# EAGLE schematic Echo Chamber (EAGLE 6.6.0)

## Sheet 1 of 3: Power Filtering
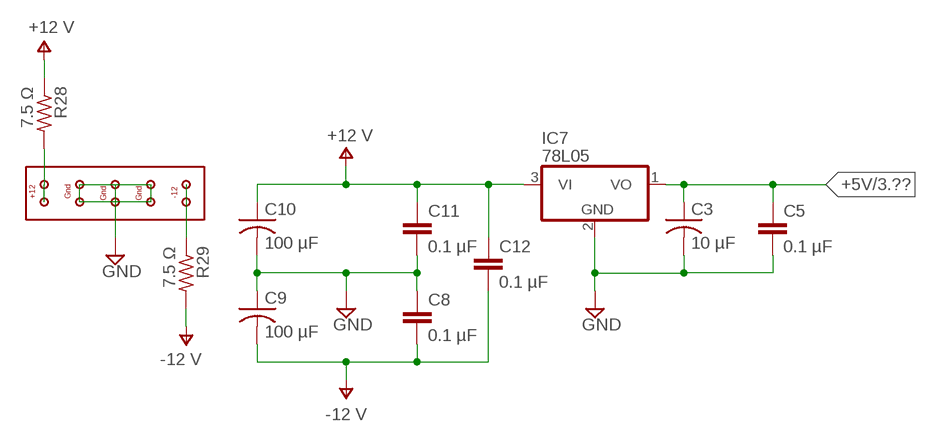
[diagram p0: schematic, sheet 1]

### Parts
C3  10 µF  C-US025-060X050  [C025-060X050]
C5  0.1 µF  C5/2.5  [C5B2.5]
C8  0.1 µF  C5/2.5  [C5B2.5]
C9  100 µF  C-US025-060X050  [C025-060X050]
C10  100 µF  C-US025-060X050  [C025-060X050]
C11  0.1 µF  C5/2.5  [C5B2.5]
C12  0.1 µF  C5/2.5  [C5B2.5]
IC7  78L05  78L05Z  [TO92]
R28  7.5 Ω  R-US_0204/7  [0204/7]
R29  7.5 Ω  R-US_0204/7  [0204/7]
U$2  EURORACK-POWER  [EURORACK-POWER]

### Nets
+5V: C3.1 C5.1 IC7.1(VO) ; also sheet 3
GND: C3.2 C5.2 C8.1 C9.1 C10.2 C11.2 IC7.2(GND) U$2.P$3 U$2.P$4 U$2.P$5 U$2.P$6 U$2.P$7 U$2.P$8 ; also sheet 2,3
N$20: R29.1 U$2.P$9 U$2.P$10
N$36: R28.2 U$2.P$1 U$2.P$2
V+: C10.1 C11.1 C12.1 IC7.3(VI) R28.1 ; supply symbol labelled +12 V
V-: C8.2 C9.2 C12.2 R29.2 ; supply symbol labelled -12 V ; also sheet 2

## Sheet 2 of 3: Audio In/Out
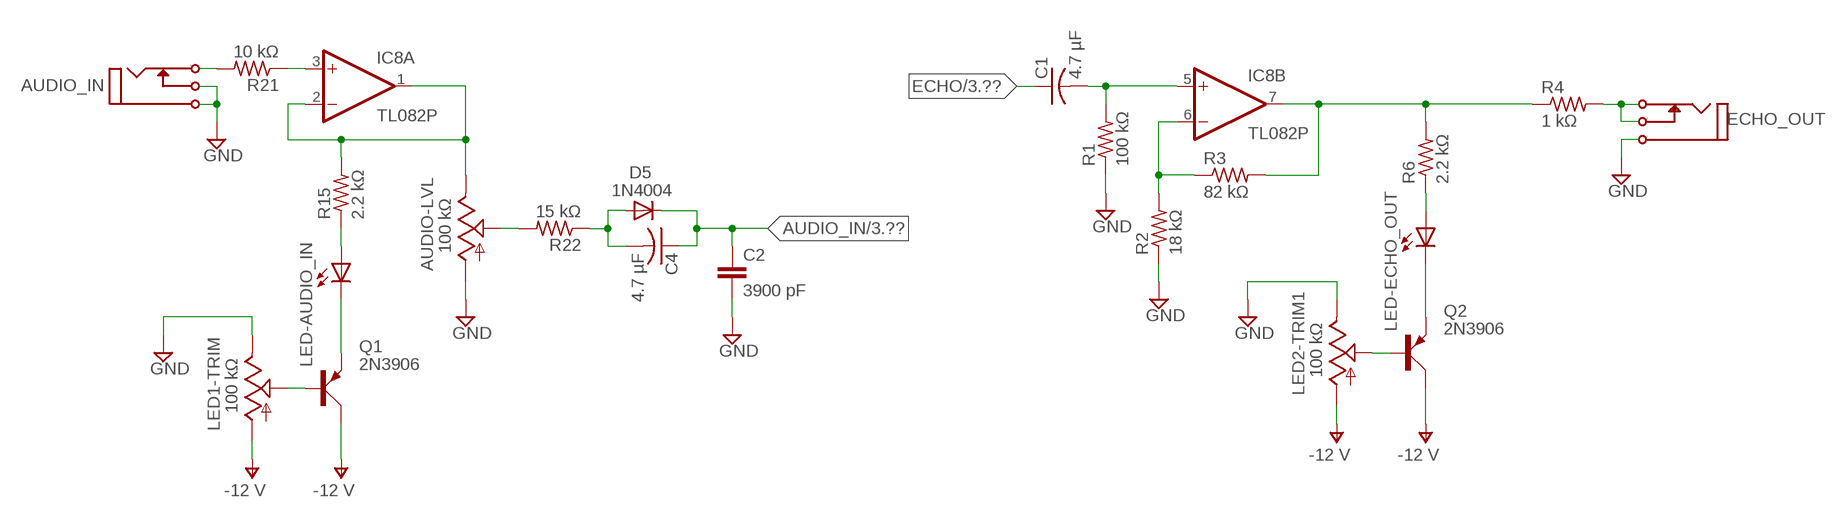
[diagram p1: schematic, sheet 2]

### Parts
AUDIO-LVL  100 kΩ  TRIM_US-B64Y  [B64Y]
AUDIO_IN  I/O  MONO_JACK  [MONO_JACK]
C1  4.7 µF  C-US025-060X050  [C025-060X050]
C2  3900 pF  C5/2.5  [C5B2.5]
C4  4.7 µF  C-US025-060X050  [C025-060X050]
D5  1N4004  [DO41-10]
ECHO_OUT  I/O  MONO_JACK  [MONO_JACK]
IC8  TL082P  [DIL08]
LED1-TRIM  100 kΩ  TRIM_US-B64Y  [B64Y]
LED2-TRIM1  100 kΩ  TRIM_US-B64Y  [B64Y]
LED-AUDIO_IN  LED3MM  [LED3MM]
LED-ECHO_OUT  LED3MM  [LED3MM]
Q1  2N3906  [TO92D]
Q2  2N3906  [TO92D]
R1  100 kΩ  R-US_0204/7  [0204/7]
R2  18 kΩ  R-US_0204/7  [0204/7]
R3  82 kΩ  R-US_0204/7  [0204/7]
R4  1 kΩ  R-US_0204/7  [0204/7]
R6  2.2 kΩ  R-US_0204/7  [0204/7]
R15  2.2 kΩ  R-US_0204/7  [0204/7]
R21  10 kΩ  R-US_0204/7  [0204/7]
R22  15 kΩ  R-US_0204/7  [0204/7]

### Nets
AUDIO_IN: C2.1 C4.1 D5.C ; also sheet 3
CV-A: AUDIO-LVL.E IC8.1(A:OUT) IC8.2(A:-IN) R15.2
ECHO: C1.1 ; also sheet 3
GND: AUDIO-LVL.A AUDIO_IN.P$1 AUDIO_IN.P$3(P3) C2.2 ECHO_OUT.P$1 LED1-TRIM.E LED2-TRIM1.E R1.1 R2.1 ; also sheet 1,3
N$1: C1.2 IC8.5(B:+IN) R1.2
N$2: IC8.6(B:-IN) R2.2 R3.1
N$3: IC8.7(B:OUT) R3.2 R4.1 R6.2
N$4: LED-AUDIO_IN.K(C) Q1.E
N$5: ECHO_OUT.P$2(P2) ECHO_OUT.P$3(P3) R4.2
N$12: IC8.3(A:+IN) R21.1
N$15: AUDIO_IN.P$2(P2) R21.2
N$21: AUDIO-LVL.S R22.2
N$26: LED-ECHO_OUT.K(C) Q2.E
N$27: LED-AUDIO_IN.A R15.1
N$30: LED-ECHO_OUT.A R6.1
N$31: LED2-TRIM1.S Q2.B
N$32: C4.2 D5.A R22.1
N$34: LED1-TRIM.S Q1.B
V-: LED1-TRIM.A LED2-TRIM1.A Q2.C ; supply symbol labelled -12 V ; also sheet 1
Unconnected: Q1.C

## Sheet 3 of 3: Echo Module
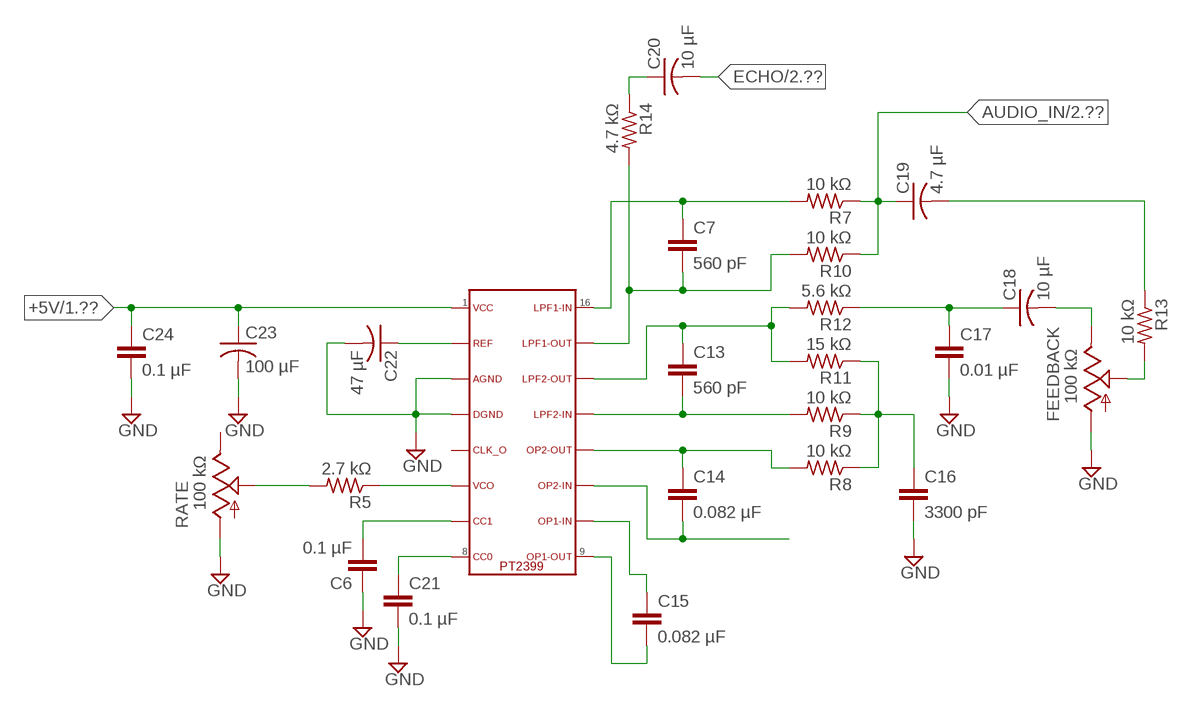
[diagram p2: schematic, sheet 3]

### Parts
C6  0.1 µF  C5/2.5  [C5B2.5]
C7  560 pF  C5/2.5  [C5B2.5]
C13  560 pF  C5/2.5  [C5B2.5]
C14  0.082 µF  C5/2.5  [C5B2.5]
C15  0.082 µF  C5/2.5  [C5B2.5]
C16  3300 pF  C5/2.5  [C5B2.5]
C17  0.01 µF  C5/2.5  [C5B2.5]
C18  10 µF  C-US025-060X050  [C025-060X050]
C19  4.7 µF  C-US025-060X050  [C025-060X050]
C20  10 µF  C-US025-060X050  [C025-060X050]
C21  0.1 µF  C5/2.5  [C5B2.5]
C22  47 µF  C-US025-060X050  [C025-060X050]
C23  100 µF  C-US025-060X050  [C025-060X050]
C24  0.1 µF  C5/2.5  [C5B2.5]
FEEDBACK  100 kΩ  TRIM_US-B64Y  [B64Y]
R5  2.7 kΩ  R-US_0204/7  [0204/7]
R7  10 kΩ  R-US_0204/7  [0204/7]
R8  10 kΩ  R-US_0204/7  [0204/7]
R9  10 kΩ  R-US_0204/7  [0204/7]
R10  10 kΩ  R-US_0204/7  [0204/7]
R11  15 kΩ  R-US_0204/7  [0204/7]
R12  5.6 kΩ  R-US_0204/7  [0204/7]
R13  10 kΩ  R-US_0204/7  [0204/7]
R14  4.7 kΩ  R-US_0204/7  [0204/7]
RATE  100 kΩ  TRIM_US-B64Y  [B64Y]
U$1  PT2399  [PT2399]

### Nets
+5V: C23.1 C24.1 U$1.1 ; also sheet 1
AUDIO_IN: C19.1 R7.1 R10.1 ; also sheet 2
ECHO: C20.2 ; also sheet 2
GND: C6.1 C16.2 C17.2 C21.2 C22.2 C23.2 C24.2 FEEDBACK.A RATE.A U$1.3 U$1.4 ; also sheet 1,2
N$6: C7.1 R7.2 U$1.16
N$7: C7.2 R10.2 R14.2 U$1.15
N$8: C13.2 R9.2 U$1.13
N$9: C14.1 R8.2 U$1.12
N$10: C17.1 C18.1 R12.1
N$11: C14.2 U$1.11
N$13: C15.1 U$1.10
N$14: C15.2 U$1.9
N$16: C16.1 R8.1 R9.1 R11.1
N$17: C20.1 R14.1
N$18: C13.1 R11.2 R12.2 U$1.14
N$19: C18.2 FEEDBACK.E
N$22: FEEDBACK.S R13.2
N$23: C19.2 R13.1
N$24: C6.2 U$1.7
N$25: C21.1 U$1.8
N$28: R5.1 U$1.6
N$29: R5.2 RATE.S
N$33: C22.1 U$1.2
Unconnected: RATE.E U$1.5

## Power pins joined to a net without a drawn wire
V+: IC8.8(P:V+)
V-: IC8.4(P:V-)

## Library data of the parts
AUDIO-LVL FEEDBACK LED1-TRIM LED2-TRIM1 RATE = pot:TRIM_US-: POTENTIOMETER
AUDIO_IN ECHO_OUT = !synth_sch:MONO_JACK
C1 C3 C4 C9 C10 C18-C20 C22 C23 = rcl:C-US: CAPACITOR, American symbol
C2 C5-C8 C11-C17 C21 C24 = capacitor-wima:C: CAPACITOR naming: grid - package width
D5 = diode:1N4004: DIODE general purpose rectifier, 1 A
IC7 = linear:78*: Positive VOLTAGE REGULATOR Source: http://cache.national.com/ds/LM/LM78L05.pdf http://www.fairchildsemi.com/ds/LM/LM7805.pdf
IC8 = linear:TL082: OP AMP Data sheet <http://www.ti.com/lit/ds/symlink/tl084a . pdf>; DATA_SHEET: <a href="http://www.ti.com/lit/ds/symlink/tl084a.pdf"> Data sheet </a>
LED-AUDIO_IN LED-ECHO_OUT = led:LED: LED OSRAM: - CHIPLED LG R971, LG N971, LY N971, LG Q971, LY Q971, LO R971, LY R971 LH N974, LH R974 LS Q976, LO Q976, LY Q976 LO Q996 - Hyper CHIPLED LW Q18S LB Q993, LB Q99A, LB R99A - SideLED LS A670, LO A670, LY A670, LG A670, LP A670 LB A673, LV A673, LT A673, LW A673 LH A674 LY A675 LS A676, LA A676, LO A676, LY A676, LW A676 LS A679, LY A679, LG A679 - Hyper Micro SIDELED® LS Y876, LA Y876, LO Y876, LY Y876 LT Y87S - SmartLED LW L88C, LW L88S LB L89C, LB L89S, LG L890 LS L89K, LO L89K, LY L89K LS L896, LA L896, LO L896, LY L896 - TOPLED LS T670, LO T670, LY T670, LG T670, LP T670 LSG T670, LSP T670, LSY T670, LOP T670, LYG T670 LG T671, LOG T671, LSG T671 LB T673, LV T673, LT T673, LW T673 LH T674 LS T676, LA T676, LO T676, LY T676, LB T676, LH T676, LSB T676, LW T676 LB T67C, LV T67C, LT T67C, LS T67K, LO T67K, LY T67K, LW E67C LS E67B, LA E67B, LO E67B, LY E67B, LB E67C, LV E67C, LT E67C LW T67C LS T679, LY T679, LG T679 LS T770, LO T770, LY T770, LG T770, LP T770 LB T773, LV T773, LT T773, LW T773 LH T774 LS E675, LA E675, LY E675, LS T675 LS T776, LA T776, LO T776, LY T776, LB T776 LHGB T686 LT T68C, LB T68C - Hyper Mini TOPLED® LB M676 - Mini TOPLED Santana® LG M470 LS M47K, LO M47K, LY M47K Source: http://www.osram.convergy.de LUXEON: - LUMILED® LXK2-PW12-R00, LXK2-PW12-S00, LXK2-PW14-U00, LXK2-PW14-V00 LXK2-PM12-R00, LXK2-PM12-S00, LXK2-PM14-U00 LXK2-PE12-Q00, LXK2-PE12-R00, LXK2-PE12-S00, LXK2-PE14-T00, LXK2-PE14-U00 LXK2-PB12-K00, LXK2-PB12-L00, LXK2-PB12-M00, LXK2-PB14-N00, LXK2-PB14-P00, LXK2-PB14-Q00 LXK2-PR12-L00, LXK2-PR12-M00, LXK2-PR14-Q00, LXK2-PR14-R00 LXK2-PD12-Q00, LXK2-PD12-R00, LXK2-PD12-S00 LXK2-PH12-R00, LXK2-PH12-S00 LXK2-PL12-P00, LXK2-PL12-Q00, LXK2-PL12-R00 Source: www.luxeon.com KINGBRIGHT: KA-3528ASYC Source: www.kingbright.com
Q1 Q2 = transistor-small-signal:2N3906: PNP TRANSISTOR
R1-R15 R21 R22 R28 R29 = resistor:R-US_: RESISTOR, American symbol
U$1 = !synth_sch:PT2399
U$2 = !synth_sch:EURORACK-POWER